# Altium project PCB_Project.PrjPcb
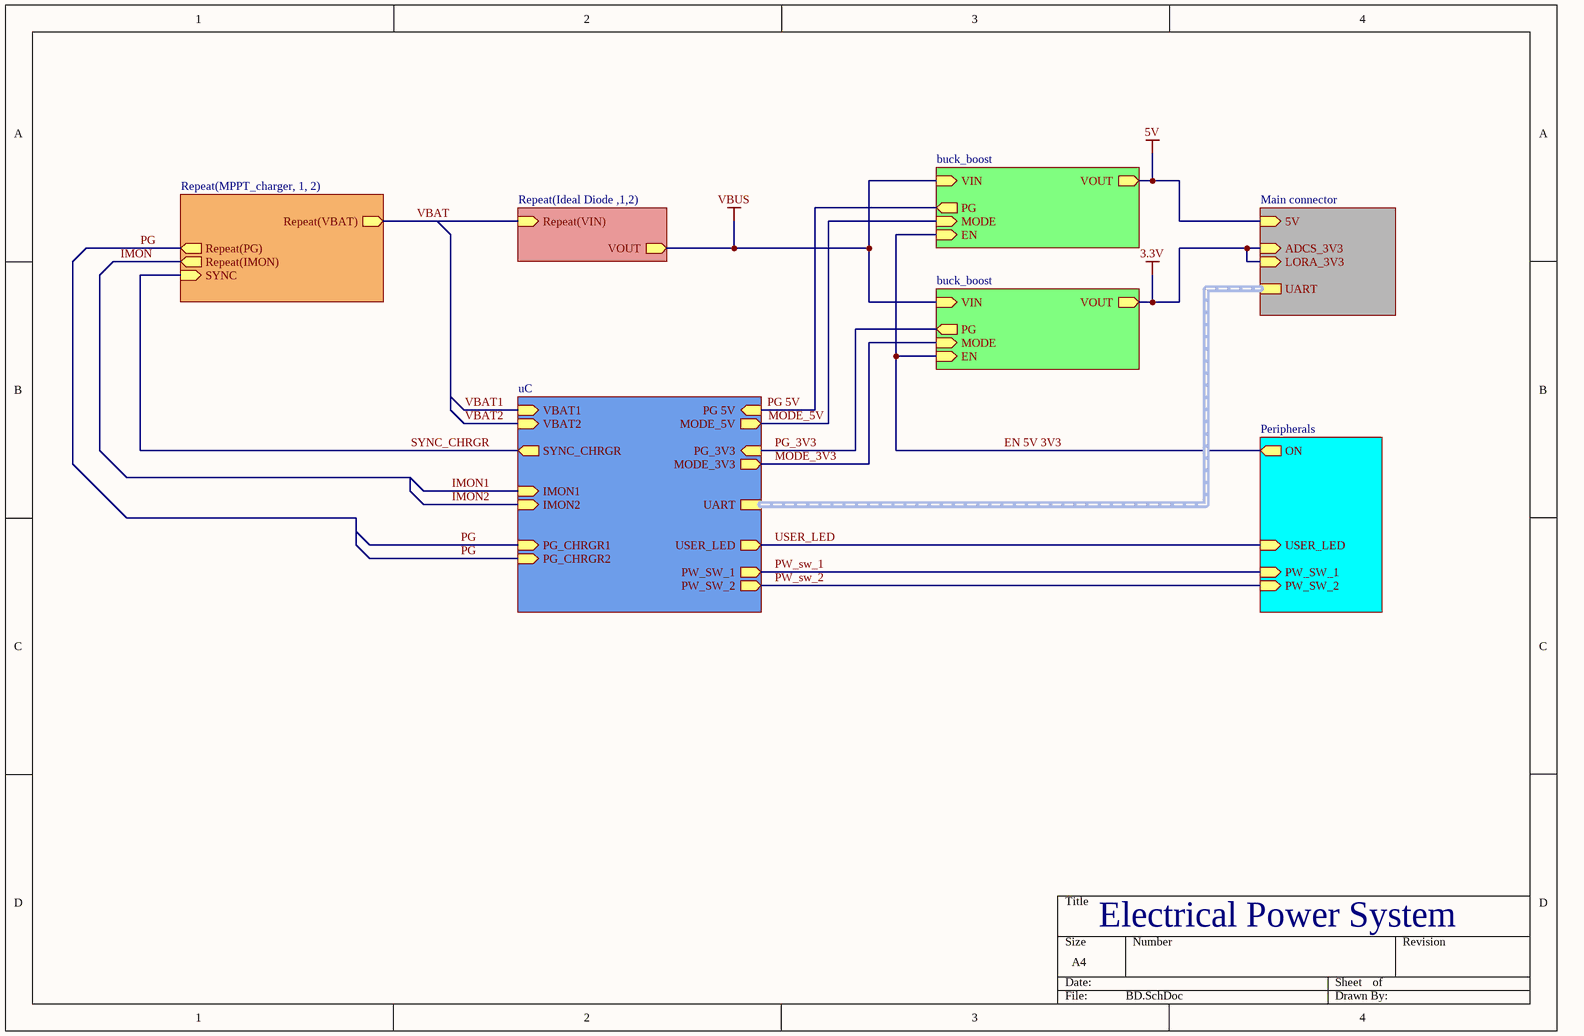
[diagram p0: BD.SchDoc]
8 sheets, 118 parts. Net scope: hierarchical (ports join the sheet entries above them; power ports are global).
Board file: 2layer.PcbDoc
Sheets:
  BD.SchDoc
    uC = Microcontroller.SchDoc
    Main connector = Board-to-board connector.SchDoc
    buck_boost = Buck-Boost converter (A).SchDoc
    buck_boost = Buck-Boost converter (B).SchDoc
    Peripherals = LED connector.SchDoc
    MPPT_charger1 = MPPT CC CV charger (A).SchDoc
    MPPT_charger2 = MPPT CC CV charger (A).SchDoc
    Ideal Diode1 = Ideal Diode (A).SchDoc
    Ideal Diode2 = Ideal Diode (A).SchDoc

## Sheet BD.SchDoc
size A4; SheetNumber: 1; SheetTotal: 10

### Sub-sheets
buck_boost = Buck-Boost converter (A).SchDoc: PG (out), VOUT (out), EN (in), MODE (in), VIN (in)
buck_boost = Buck-Boost converter (B).SchDoc: PG (out), VOUT (out), EN (in), MODE (in), VIN (in)
Main connector = Board-to-board connector.SchDoc: 5V (in), UART (harness UART), ADCS_3V3 (in), LORA_3V3 (in)
Peripherals = LED connector.SchDoc: USER_LED (in), ON (out), PW_SW_2 (in), PW_SW_1 (in)
Repeat(Ideal Diode ,1,2) = Ideal Diode (A).SchDoc: Repeat(VIN) (in), VOUT (out)
Repeat(MPPT_charger, 1, 2) = MPPT CC CV charger (A).SchDoc: Repeat(IMON) (out), SYNC (in), Repeat(PG) (out), Repeat(VBAT) (out)
uC = Microcontroller.SchDoc: IMON1 (in), IMON2 (in), PG_3V3 (in), SYNC_CHRGR (out), MODE_3V3 (out), PG 5V (in), MODE_5V (out), PG_CHRGR1 (in), PG_CHRGR2 (in), PW_SW_2 (out), PW_SW_1 (out), USER_LED (out), UART (harness UART), VBAT1 (in), VBAT2 (in)

### Nets
3.3V: sheet Main connector/ADCS_3V3, sheet Main connector/LORA_3V3, sheet buck_boost/VOUT
5V: sheet Main connector/5V, sheet buck_boost/VOUT
VBUS: sheet buck_boost/VIN, sheet buck_boost/VIN, sheet Repeat(Ideal Diode ,1,2)/VOUT
EN 5V 3V3: sheet buck_boost/EN, sheet buck_boost/EN, sheet Peripherals/ON
IMON: sheet Repeat(MPPT_charger, 1, 2)/Repeat(IMON)
MODE_3V3: sheet uC/MODE_3V3, sheet buck_boost/MODE
MODE_5V: sheet uC/MODE_5V, sheet buck_boost/MODE
PG: sheet uC/PG_CHRGR1, sheet uC/PG_CHRGR2, sheet Repeat(MPPT_charger, 1, 2)/Repeat(PG)
PG 5V: sheet uC/PG 5V, sheet buck_boost/PG
PG_3V3: sheet uC/PG_3V3, sheet buck_boost/PG
PW_sw_1: sheet uC/PW_SW_1, sheet Peripherals/PW_SW_1
PW_sw_2: sheet uC/PW_SW_2, sheet Peripherals/PW_SW_2
SYNC_CHRGR: sheet uC/SYNC_CHRGR, sheet Repeat(MPPT_charger, 1, 2)/SYNC
USER_LED: sheet uC/USER_LED, sheet Peripherals/USER_LED
VBAT: sheet Repeat(MPPT_charger, 1, 2)/Repeat(VBAT), sheet Repeat(Ideal Diode ,1,2)/Repeat(VIN)

### Buses and harness runs
harness sheet Main connector/UART = sheet uC/UART

### Notes on the sheet
- Electrical Power System

## Sheet Microcontroller.SchDoc
size A3; SheetNumber: 2; SheetTotal: 8
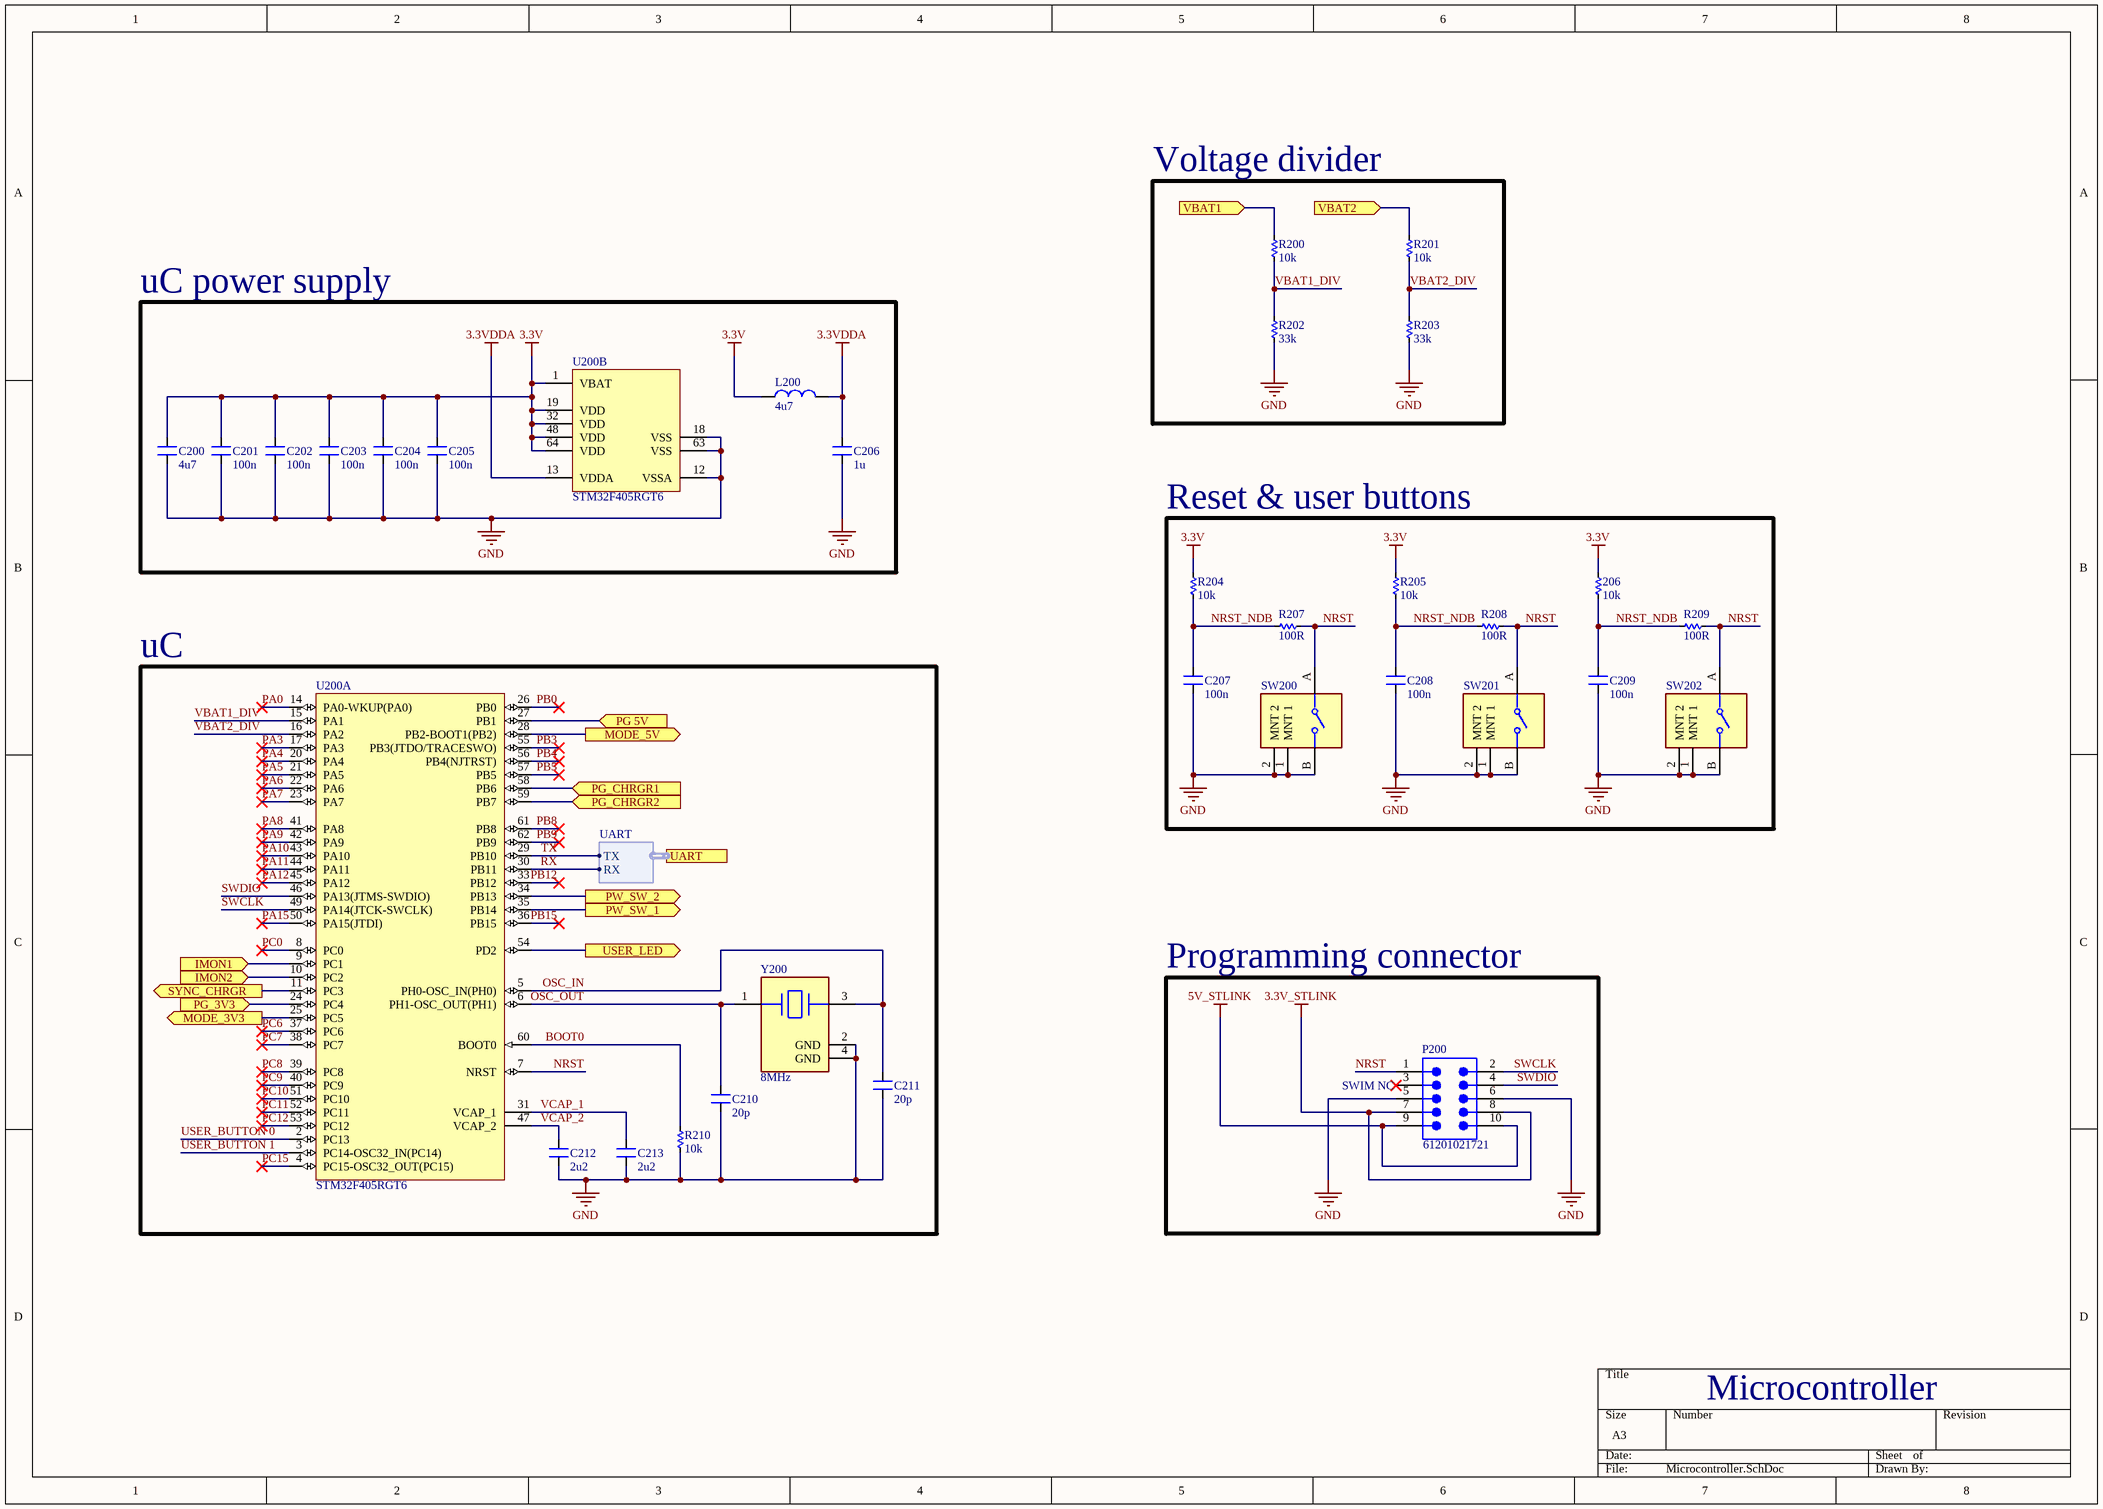
[diagram p1: Microcontroller.SchDoc]

### Parts
206  10k  [RES-SMD-0603]
C200  4u7  [CN-SMD-0603]
C201  100n  [CN-SMD-0603]
C202  100n  [CN-SMD-0603]
C203  100n  [CN-SMD-0603]
C204  100n  [CN-SMD-0603]
C205  100n  [CN-SMD-0603]
C206  1u  [CN-SMD-0603]
C207  100n  [CN-SMD-0603]
C208  100n  [CN-SMD-0603]
C209  100n  [CN-SMD-0603]
C210  20p  [CN-SMD-0603]
C211  20p  [CN-SMD-0603]
C212  2u2  [CN-SMD-0603]
C213  2u2  [CN-SMD-0603]
L200  4u7  [L-SMD-0630]
P200  61201021721  [61201021721]
R200  10k  [RES-SMD-0603]
R201  10k  [RES-SMD-0603]
R202  33k  [RES-SMD-0603]
R203  33k  [RES-SMD-0603]
R204  10k  [RES-SMD-0603]
R205  10k  [RES-SMD-0603]
R207  100R  [RES-SMD-0603]
R208  100R  [RES-SMD-0603]
R209  100R  [RES-SMD-0603]
R210  10k  [RES-SMD-0603]
SW200  EVQ-PF006K  [FP-EVQ-PF006K-MFG]  (value not drawn)
SW201  EVQ-PF006K  [FP-EVQ-PF006K-MFG]  (value not drawn)
SW202  EVQ-PF006K  [FP-EVQ-PF006K-MFG]  (value not drawn)
U200  STM32F405RGT6  [STM-LQFP64_M]  (parts A,B of 2)
Y200  8MHz  [FP-ABM3B-MFG]

### Blocks framed on the sheet
Voltage divider: R200-R203
Reset & user buttons: 206 C207-C209 R204 R205 R207-R209 SW200-SW202
uC: C210-C213 R210 U200 Y200
Programming connector: P200

### Ports
IMON1 (in, see BD[2B]), IMON2 (in, see BD[2B]), MODE_3V3 (out, see BD[2B]), MODE_5V (out, see BD[2B]), PG 5V (in, see BD[2B]), PG_3V3 (in, see BD[2B]), PG_CHRGR1 (in, see BD[2C]), PG_CHRGR2 (in, see BD[2C]), PW_SW_1 (out, see BD[2C], LED connector[2B]), PW_SW_2 (out, see BD[2C], LED connector[2C]), SYNC_CHRGR (out, see BD[2B]), UART (harness UART, see BD[2B], Board-to-board connector[2C]), USER_LED (out, see BD[2C], LED connector[1B]), VBAT1 (in, see BD[2B]), VBAT2 (in, see BD[2B])

### Harnesses
UART: TX, RX

### Nets
3.3V: 206.1 C200.2 C201.2 C202.2 C203.2 C204.2 C205.2 L200.1 R204.1 R205.1 U200.1(VBAT) U200.19(VDD) U200.32(VDD) U200.48(VDD) U200.64(VDD)
3.3V_STLINK: P200.7 P200.8
3.3VDDA: C206.2 L200.2 U200.13(VDDA)
5V_STLINK: P200.9 P200.10
GND: C200.1 C201.1 C202.1 C203.1 C204.1 C205.1 C206.1 C207.1 C208.1 C209.1 C210.1 C211.1 C212.1 C213.1 P200.5 P200.6 R202.2 R203.2 R210.2 SW200.1(MNT_1) SW200.2(MNT_2) SW200.B SW201.1(MNT_1) SW201.2(MNT_2) SW201.B SW202.1(MNT_1) SW202.2(MNT_2) SW202.B U200.12(VSSA) U200.18(VSS) U200.63(VSS) Y200.2(GND) Y200.4(GND)
BIAS_A: R200.1 ; port VBAT1
BIAS_A: R201.1 ; port VBAT2  [a separate net that carries the same name]
BOOT0: R210.1 U200.60(BOOT0)
IMON1: U200.9(PC1) ; port IMON1
IMON2: U200.10(PC2) ; port IMON2
MODE_3V3: U200.25(PC5) ; port MODE_3V3
MODE_5V: U200.28(PB2-BOOT1(PB2)) ; port MODE_5V
NRST: P200.1 R207.2 R208.2 R209.2 SW200.A SW201.A SW202.A U200.7(NRST)
NRST_NDB: 206.2 C207.2 C208.2 C209.2 R204.2 R205.2 R207.1 R208.1 R209.1
OSC_IN: C211.2 U200.5(PH0-OSC_IN(PH0)) Y200.3
OSC_OUT: C210.2 U200.6(PH1-OSC_OUT(PH1)) Y200.1
PA0: U200.14(PA0-WKUP(PA0))
PA3: U200.17(PA3)
PA4: U200.20(PA4)
PA5: U200.21(PA5)
PA6: U200.22(PA6)
PA7: U200.23(PA7)
PA8: U200.41(PA8)
PA9: U200.42(PA9)
PA10: U200.43(PA10)
PA11: U200.44(PA11)
PA12: U200.45(PA12)
PA15: U200.50(PA15(JTDI))
PB0: U200.26(PB0)
PB3: U200.55(PB3(JTDO/TRACESWO))
PB4: U200.56(PB4(NJTRST))
PB5: U200.57(PB5)
PB8: U200.61(PB8)
PB9: U200.62(PB9)
PB12: U200.33(PB12)
PB15: U200.36(PB15)
PC0: U200.8(PC0)
PC6: U200.37(PC6)
PC7: U200.38(PC7)
PC8: U200.39(PC8)
PC9: U200.40(PC9)
PC10: U200.51(PC10)
PC11: U200.52(PC11)
PC12: U200.53(PC12)
PC15: U200.4(PC15-OSC32_OUT(PC15))
PG: U200.58(PB6) U200.59(PB7) ; port PG_CHRGR1, port PG_CHRGR2
PG 5V: U200.27(PB1) ; port PG 5V
PG_3V3: U200.24(PC4) ; port PG_3V3
PW_sw_1: U200.35(PB14) ; port PW_SW_1
PW_sw_2: U200.34(PB13) ; port PW_SW_2
RX: U200.30(PB11) ; port UART.RX
SWCLK: P200.2 U200.49(PA14(JTCK-SWCLK))
SWDIO: P200.4 U200.46(PA13(JTMS-SWDIO))
SYNC_CHRGR: U200.11(PC3) ; port SYNC_CHRGR
TX: U200.29(PB10) ; port UART.TX
USER_BUTTON 0: U200.2(PC13)
USER_BUTTON 1: U200.3(PC14-OSC32_IN(PC14))
USER_LED: U200.54(PD2) ; port USER_LED
VBAT1_DIV: R200.2 R202.1 U200.15(PA1)
VBAT2_DIV: R201.2 R203.1 U200.16(PA2)
VCAP_1: C213.2 U200.31(VCAP_1)
NetC212_2: C212.2 U200.47(VCAP_2)

Not connected (* = marked no-connect by the designer): P200 3*

### Notes on the sheet
- uC power supply
- (near P200) SWIM NC
- Microcontroller
- Labels drawn without touching a wire or pin: VCAP_2

### Library data of the parts
206 R200-R205 R207-R210 = Res-SMD: Resistor; Manufacturer: Generic Components; Class: Passive; Published: 08/06/2000; Publisher: Altium Hobart Technology Centre
C200-C213 = CN: Value: 33pF
L200 = L-SMD-1: partNo: 78477010; Manufacturer: Wurth Elektronik; Inductance: 1.0 μH; ComponentLink1Description: Manufacturer; ComponentLink1URL: http://www.we-online.de; Created by: Baojun Chen; Created Date: Nov.2015; ComponentLink2Description: Datasheet; ComponentLink2URL: http://katalog.we-online.de/pbs/datasheet/78477010.pdf
P200 = CMP-1502-00021-2: NexarPartId: 8917787; Operating Supply Voltage: 250V; Number of Positions: 10; Contact Resistance: 20mΩ; Connector Type: Male Pin; Current Rating: 3A; Pitch: 2.54mm; Gender: Male; Insulation Resistance: 1GΩ; Insulation: Insulated; Max Operating Temperature: 105°C; Flammability Rating: UL94 V-0; Mount: Through Hole; Contact Material: Copper; Min Operating Temperature: -40°C; Length: 20.36mm; Number of Contacts: 10; Height: 8.85mm; Number of Rows: 2; Housing Material: PBT; Color: Black; Contact Gender: Male; Orientation: Right Angle; Contact Plating: Gold; Number of Pins: 10; Voltage Rating (DC): 250V; RoHS: Compliant; Insulation Material: PBT; REACH SVHC: Unknown; Row Spacing: 2.54mm; Voltage Rating: 250V; Width: 20.36mm; Lead Pitch: 2.54mm; Termination: Through Hole
SW200-SW202 = CMP-00287-39802768-1: EVQ-PF006K Switch Tactile N.O. SPST Round Button PC Pins 0.02A 15VDC 1N Thru-Hole Bulk; Voltage Rating (DC): 15V; Current Rating: 20mA; Actuator Length: 5.85mm; Life (Cycles): 100kcycles; Number of Positions: 2; Switch Function: Off-Mom; Switch Travel: 250µm; Contact Resistance: 50mΩ; Illumination Type: Illuminated, Non-Illuminated; NexarPartId: 39802768; Max Current Rating: 20mA; Color: Black; Height: 7.1mm; Throw Configuration: SPST; Width: 4mm; Packaging: Bulk; Mount: Through Hole; Operating Force: 1N; Lead Free: Lead Free; Contact Current Rating: 20mA; Length: 6.2mm; Max Operating Temperature: 70°C; Min Operating Temperature: -20°C; Contact Plating: Gold, Silver; Orientation: Right Angle; REACH SVHC: No SVHC; Termination: PC Pins; Mechanical Life: 100kcycles; Radiation Hardening: No; Electrical Life: 100kcycles; RoHS: Compliant; Max Voltage Rating (DC): 15V; Depth: 9.85mm
U200 = CMP-0243-00019-3: ARM Cortex-M4 32-bit MCU+FPU, 210 DMIPS, 1024 kB Flash, 192 kB Internal RAM, 51 I/Os, 64-pin LQFP, -40 to 85 degC, Tray; Manufacturer: STMicroelectronics; Supply Voltage(Vcc) min (V): 1.8; Supply Voltage(Vcc) max (V): 3.6; Internal RAM Size (kB): 192; I/Os (High Current): 51; D/A Converter: 2x12-bit; FLASH Size (Prog) (kB): 1024; Operating Frequency(F) (Processor speed) (MHz): 168; ComponentLink2Description: Datasheet; PackageVersion: Rev. 4, 06/2013; DatasheetVersion: Rev. 4; Core: ARM Cortex-M4; ComponentLink2URL: http://www.st.com/st-web-ui/static/active/en/resource/technical/document/datasheet/DM00037051.pdf; PackageReference: LQFP64; Packing: Tray; ComponentLink1Description: Manufacturer URL; ComponentLink3URL: http://www.st.com/st-web-ui/static/active/en/resource/technical/document/datasheet/DM00037051.pdf; ComponentLink3Description: Package Specification; Mounting Technology: Surface Mount; ComponentLink1URL: http://www.st.com/web/en/home.html; PackageDescription: 64-Pin Low Profile Quad Flat Package, 10 x 10 mm Body, 0.5 mm Pitch; PartNumber: STM32F405RGT6
Y200 = CMP-1688-00002-2: Crystal 8MHz ±20ppm 18pF SMD-4 5mm x 3.2mm; ESR (Equivalent Series Resistance): 200R; Frequency Stability: 50ppm; Operating Frequency: 8 MHz; Mount: Surface Mount; Number of Pins: 4; Packaging: Tape and Reel; Width: 0.126inch; Case/Package: CSMD; Lead Free: Lead Free; Depth: 3.2mm; Load Capacitance: 18pF; Min Operating Temperature: -20°C; Series: ABM3B; Package Quantity: 1000; Resistor Type: Ceramic; Height: 0.043inch; Max Operating Temperature: 70°C; Frequency Tolerance: 20ppm; Series Resistance: 200R; Tolerance: 20ppm; Termination: SMD/SMT; Length: 5mm; Frequency: 8MHz

## Sheet Board-to-board connector.SchDoc
size A4; SheetNumber: 7; SheetTotal: 8
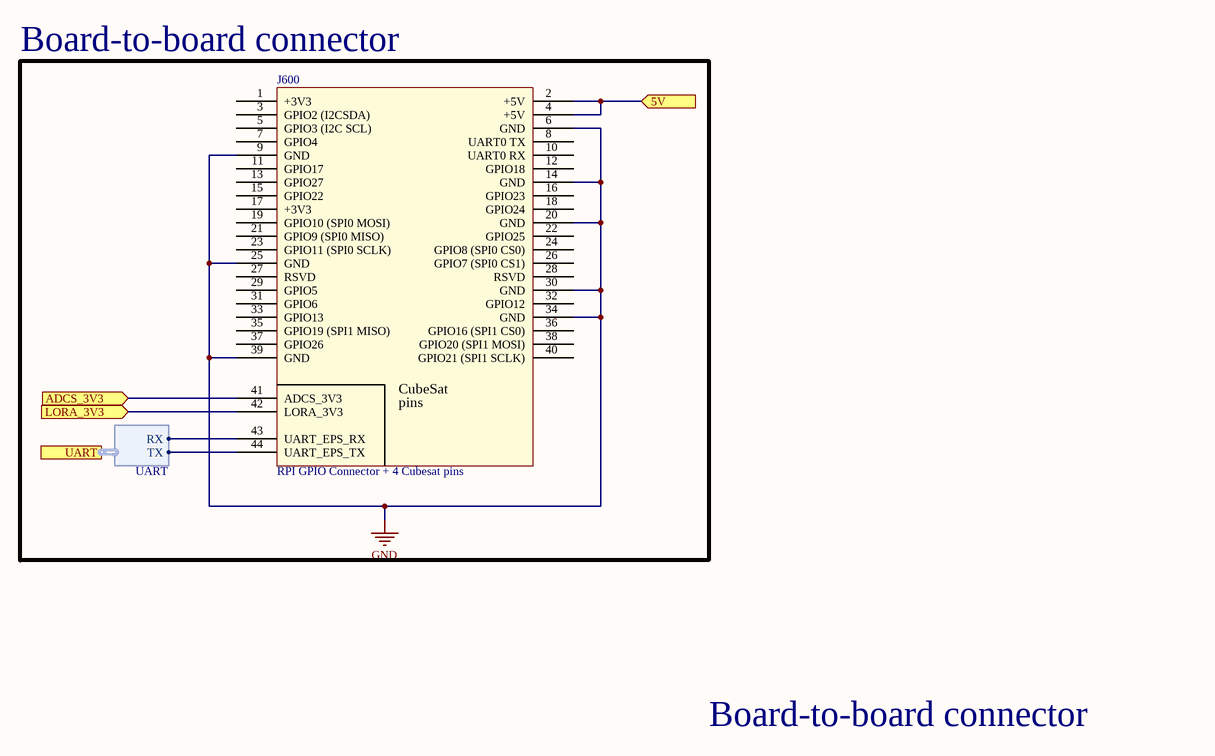
[diagram p2: Board-to-board connector.SchDoc]

### Parts
J600  RPI GPIO Connector + 4 Cubesat pins  [header 40 pins]

### Blocks framed on the sheet
Board-to-board connector: J600

### Ports
5V (in), ADCS_3V3 (in), LORA_3V3 (in), UART (harness UART, see Microcontroller[3C])

### Harnesses
UART: TX, RX

### Nets
3.3V: J600.41(ADCS_3V3) J600.42(LORA_3V3) ; port ADCS_3V3, port LORA_3V3
5V: J600.2(+5V) J600.4(+5V) ; port 5V
GND: J600.6(GND) J600.9(GND) J600.14(GND) J600.20(GND) J600.25(GND) J600.30(GND) J600.34(GND) J600.39(GND)
RX: J600.43(UART_EPS_RX) ; port UART.RX
TX: J600.44(UART_EPS_TX) ; port UART.TX

Not connected (* = marked no-connect by the designer): J600 1(+3V3) 3(GPIO2_(I2CSDA)) 5(GPIO3_(I2C_SCL)) 7(GPIO4) 8(UART0_TX) 10(UART0_RX) 11(GPIO17) 12(GPIO18) 13(GPIO27) 15(GPIO22) 16(GPIO23) 17(+3V3) 18(GPIO24) 19(GPIO10_(SPI0_MOSI)) 21(GPIO9_(SPI0_MISO)) 22(GPIO25) 23(GPIO11_(SPI0_SCLK)) 24(GPIO8_(SPI0_CS0)) 26(GPIO7_(SPI0_CS1)) 27(RSVD) 28(RSVD) 29(GPIO5) 31(GPIO6) 32(GPIO12) 33(GPIO13) 35(GPIO19_(SPI1_MISO)) 36(GPIO16_(SPI1_CS0)) 37(GPIO26) 38(GPIO20_(SPI1_MOSI)) 40(GPIO21_(SPI1_SCLK))

### Notes on the sheet
- Board-to-board connector
- (in symbol Header 40 pins) CubeSat; pins

### Library data of the parts
J600 = Header 40 pins

## Sheet Buck-Boost converter (A).SchDoc
size A4; SheetNumber: 5; SheetTotal: 10
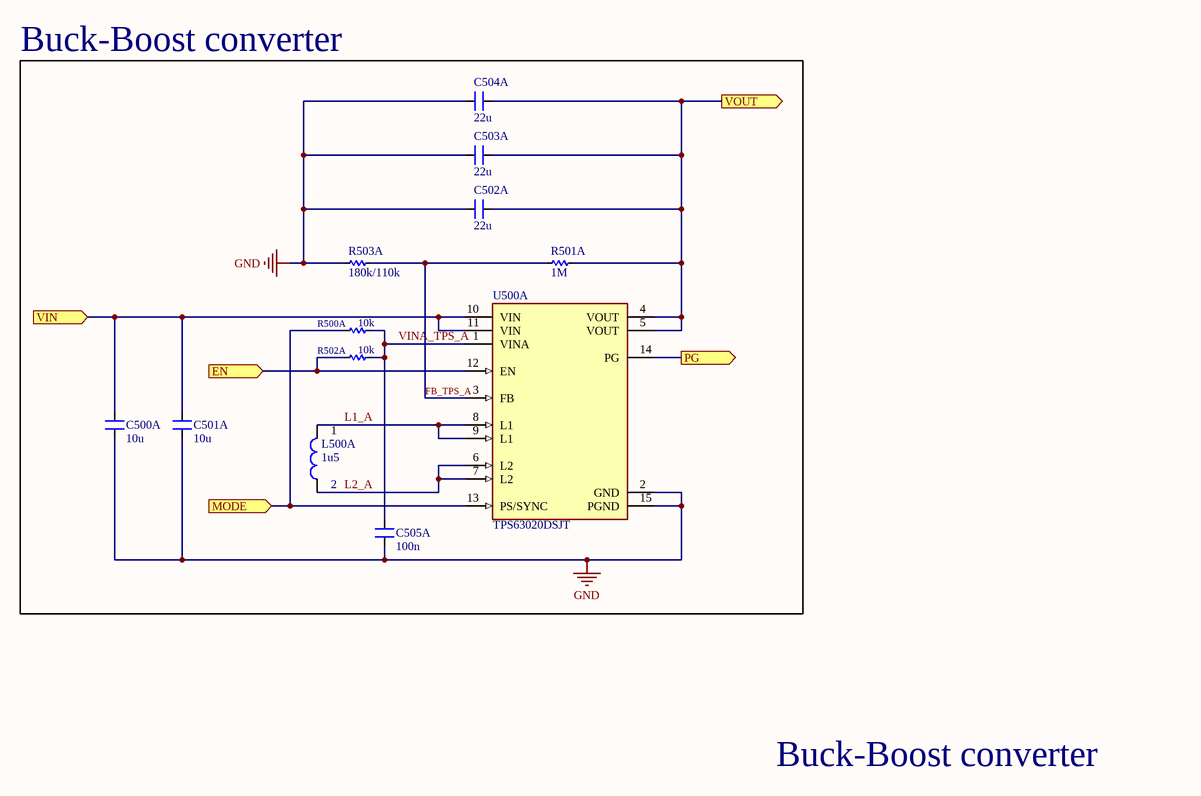
[diagram p3: Buck-Boost converter (A).SchDoc]

### Parts
C500A  10u  [CN-SMD-0603]
C501A  10u  [CN-SMD-0603]
C502A  22u  [CN-SMD-0603]
C503A  22u  [CN-SMD-0603]
C504A  22u  [CN-SMD-0603]
C505A  100n  [CN-SMD-0603]
L500A  1u5  [L-SMD-0630]
R500A  10k  [RES-SMD-0603]
R501A  1M  [RES-SMD-0603]
R502A  10k  [RES-SMD-0603]
R503A  180k/110k  [RES-SMD-0603]
U500A  TPS63020DSJT  [FP-DSJ0014A-MFG]

### Ports
EN (in, see BD[3A], Buck-Boost converter (B)[2C]), MODE (in, see BD[3A]), PG (out, see BD[3A]), VIN (in, see BD[3A], Buck-Boost converter (B)[1B]), VOUT (out, see BD[3A])

### Nets
5V: C502A.1 C503A.1 C504A.1 R501A.1 U500A.4(VOUT) U500A.5(VOUT) ; port VOUT
GND: C500A.1 C501A.1 C502A.2 C503A.2 C504A.2 C505A.1 R503A.2 U500A.2(GND) U500A.15(PGND)
VBUS: C500A.2 C501A.2 U500A.10(VIN) U500A.11(VIN) ; port VIN
EN 5V 3V3: R502A.2 U500A.12(EN) ; port EN
FB_TPS_A: R501A.2 R503A.1 U500A.3(FB)
L1_A: L500A.2 U500A.8(L1) U500A.9(L1)
L2_A: L500A.1 U500A.6(L2) U500A.7(L2)
MODE_5V: R500A.2 U500A.13(PS/SYNC) ; port MODE
PG 5V: U500A.14(PG) ; port PG
VINA_TPS_A: C505A.2 R500A.1 R502A.1 U500A.1(VINA)

### Notes on the sheet
- Buck-Boost converter
- (near L500A) 1
- (near L500A) 2

### Library data of the parts
C500A C501A C502A C503A C504A C505A = CN: Value: 33pF
L500A = L-SMD-1: as L200 on sheet Microcontroller; ComponentLink1Description: Manufacturer; ComponentLink1URL: http://www.we-online.de; Created by: Baojun Chen; Created Date: Nov.2015; ComponentLink2Description: Datasheet; ComponentLink2URL: http://katalog.we-online.de/pbs/datasheet/78477010.pdf
R500A R501A R502A R503A = Res-SMD: as 206 on sheet Microcontroller; Published: 08/06/2000; Publisher: Altium Hobart Technology Centre
U500A = CMP-2000-07282-2: IC REG BCK BST ADJ 3.5A 14VSON; Manufacturer: Texas Instruments; Switching Frequency: 2400kHz; Output Voltage: 1.2-5.5V; Nominal Supply Current: 25uA; Standoff Height: 0mm; Switching Topology: Buck-Boost; Min Supply Voltage: 1.8V; Output Type: AdjustableProgrammable; Max Junction Temp: +125°C; Number Of Outputs: 1; Output Current: 3A; Max Supply Voltage: 5.5V; ComponentLink2URL: https://www.ti.com/lit/ds/symlink/tps63020.pdf; Ambient Temperature Range High: +85°C; Digikey Description: IC REG BCK BST ADJ 3.5A 14VSON; Ambient Temperature Range Low: -40°C; Manufacturer Part Number: TPS63020DSJT; Automotive: No; Package: DSJ0014A; Category: IC; Temperature Range High: +85°C; Temperature: -40°C to +85°C; Octopart: https://octopart.com/tps63020dsjt-texas+instruments-12976119; Temperature Range Low: -40°C; Device Class L3: Voltage Regulators - Switching; Device Class L2: Power Management ICs; RoHS: TRUE; Lead Free: Yes; Height: 1mm; Device Class L1: Integrated Circuits (ICs); Mouser Description: Voltage Regulators - Switching Regulators 93% Eff Buck-Boost Converter; ComponentLink2Description: Datasheet

## Sheet Buck-Boost converter (B).SchDoc
size A4; SheetNumber: 6; SheetTotal: 8
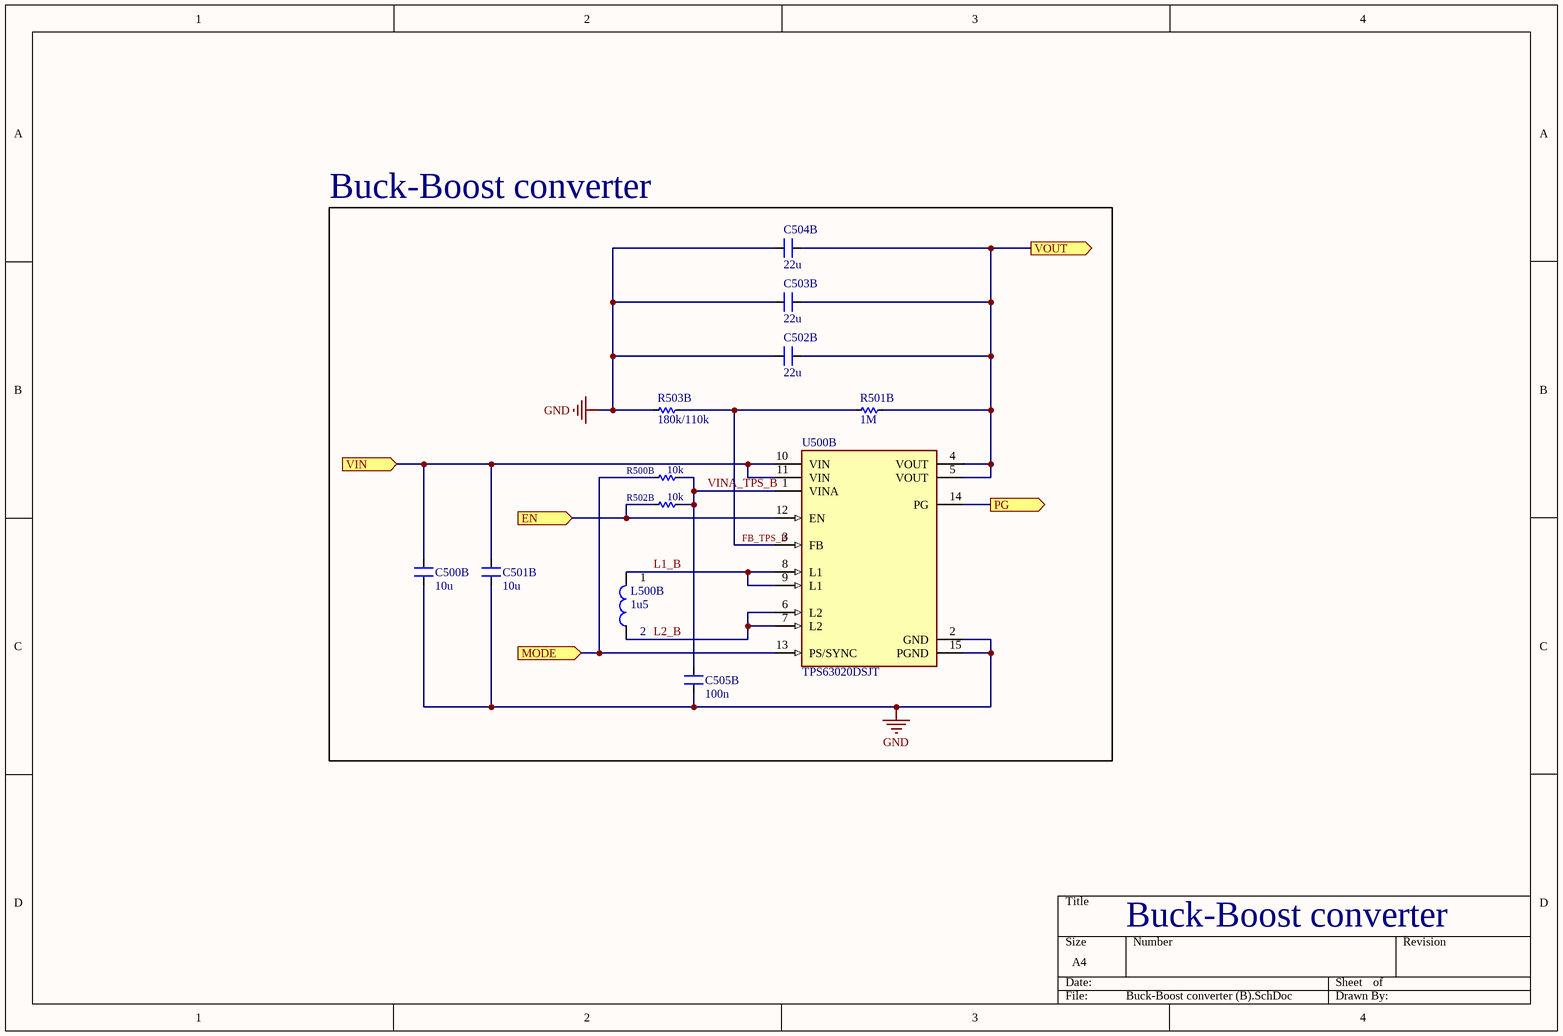
[diagram p4: Buck-Boost converter (B).SchDoc]

### Parts
C500B  10u  [CN-SMD-0603]
C501B  10u  [CN-SMD-0603]
C502B  22u  [CN-SMD-0603]
C503B  22u  [CN-SMD-0603]
C504B  22u  [CN-SMD-0603]
C505B  100n  [CN-SMD-0603]
L500B  1u5  [L-SMD-0630]
R500B  10k  [RES-SMD-0603]
R501B  1M  [RES-SMD-0603]
R502B  10k  [RES-SMD-0603]
R503B  180k/110k  [RES-SMD-0603]
U500B  TPS63020DSJT  [FP-DSJ0014A-MFG]

### Ports
EN (in, see Buck-Boost converter (A)[2C]), MODE (in, see Buck-Boost converter (A)[2C]), PG (out, see Buck-Boost converter (A)[3C], MPPT CC CV charger (A)[3B], MPPT CC CV charger (B)[3B]), VIN (in, see Buck-Boost converter (A)[1B], Ideal Diode[1B], Ideal Diode[3B]), VOUT (out, see Buck-Boost converter (A)[3B])

### Nets
3.3V: C502B.1 C503B.1 C504B.1 R501B.1 U500B.4(VOUT) U500B.5(VOUT) ; port VOUT
GND: C500B.1 C501B.1 C502B.2 C503B.2 C504B.2 C505B.1 R503B.2 U500B.2(GND) U500B.15(PGND)
VBUS: C500B.2 C501B.2 U500B.10(VIN) U500B.11(VIN) ; port VIN
EN 5V 3V3: R502B.2 U500B.12(EN) ; port EN
FB_TPS_B: R501B.2 R503B.1 U500B.3(FB)
L1_B: L500B.2 U500B.8(L1) U500B.9(L1)
L2_B: L500B.1 U500B.6(L2) U500B.7(L2)
MODE_3V3: R500B.2 U500B.13(PS/SYNC) ; port MODE
PG_3V3: U500B.14(PG) ; port PG
VINA_TPS_B: C505B.2 R500B.1 R502B.1 U500B.1(VINA)

### Notes on the sheet
- Buck-Boost converter
- (near L500B) 1
- (near L500B) 2

### Library data of the parts
C500B C501B C502B C503B C504B C505B = CN: Value: 33pF
L500B = L-SMD-1: as L200 on sheet Microcontroller; ComponentLink1Description: Manufacturer; ComponentLink1URL: http://www.we-online.de; Created by: Baojun Chen; Created Date: Nov.2015; ComponentLink2Description: Datasheet; ComponentLink2URL: http://katalog.we-online.de/pbs/datasheet/78477010.pdf
R500B R501B R502B R503B = Res-SMD: as 206 on sheet Microcontroller; Published: 08/06/2000; Publisher: Altium Hobart Technology Centre
U500B = CMP-2000-07282-2: as U500A on sheet Buck-Boost converter (A); ComponentLink2URL: https://www.ti.com/lit/ds/symlink/tps63020.pdf; Ambient Temperature Range High: +85°C; Digikey Description: IC REG BCK BST ADJ 3.5A 14VSON; Ambient Temperature Range Low: -40°C; Manufacturer Part Number: TPS63020DSJT; Automotive: No; Package: DSJ0014A; Category: IC; Temperature Range High: +85°C; Temperature: -40°C to +85°C; Octopart: https://octopart.com/tps63020dsjt-texas+instruments-12976119; Temperature Range Low: -40°C; Device Class L3: Voltage Regulators - Switching; Device Class L2: Power Management ICs; RoHS: TRUE; Lead Free: Yes; Height: 1mm; Device Class L1: Integrated Circuits (ICs); Mouser Description: Voltage Regulators - Switching Regulators 93% Eff Buck-Boost Converter; ComponentLink2Description: Datasheet

## Sheet LED connector.SchDoc
size A4; SheetNumber: 8; SheetTotal: 8
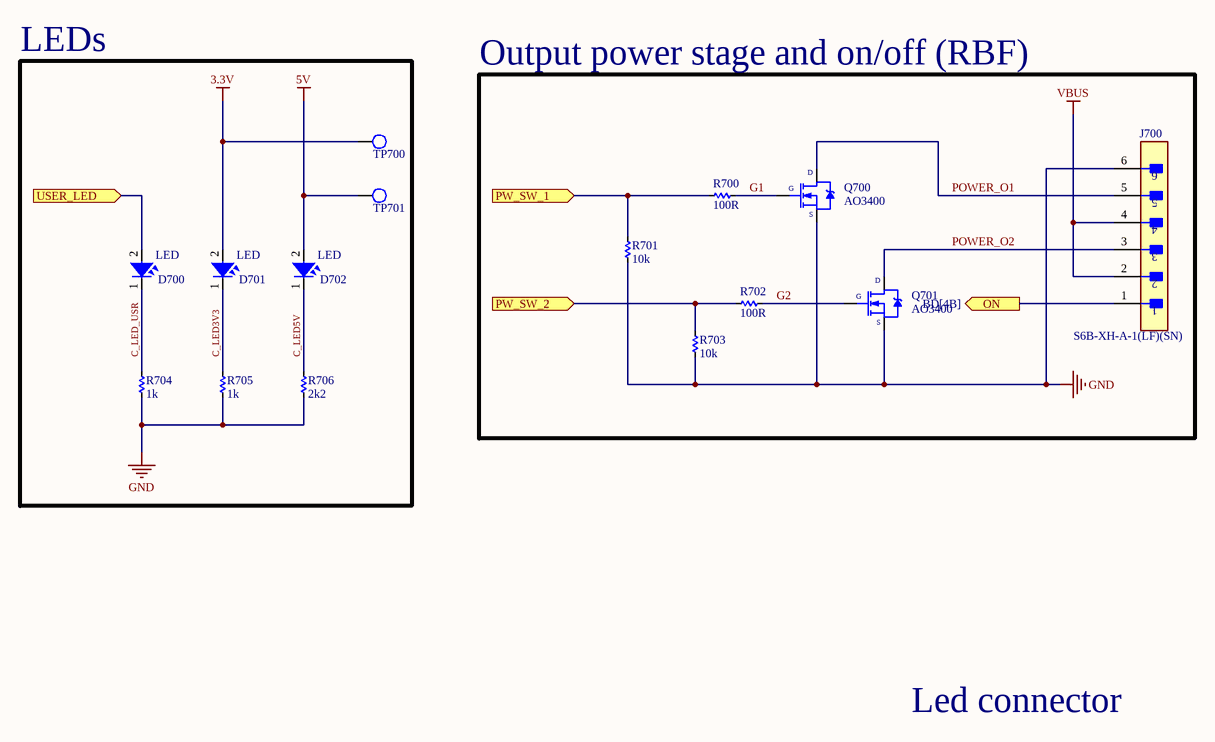
[diagram p5: LED connector.SchDoc]

### Parts
D700  LED  [LED-0805-Green]
D701  LED  [LED-0805-Green]
D702  LED  [LED-0805-Green]
J700  S6B-XH-A-1(LF)(SN)  [FP-S6B-XH-A-1_LF_SN-MFG]
Q700  AO3400  [SOT23-123]
Q701  AO3400  [SOT23-123]
R700  100R  [RES-SMD-0603]
R701  10k  [RES-SMD-0603]
R702  100R  [RES-SMD-0603]
R703  10k  [RES-SMD-0603]
R704  1k  [RES-SMD-0603]
R705  1k  [RES-SMD-0603]
R706  2k2  [RES-SMD-0603]
TP700  Test-Point  [TESTPOINT]  (value not drawn)
TP701  Test-Point  [TESTPOINT]  (value not drawn)

### Blocks framed on the sheet
LEDs: D700-D702 R704-R706 TP700 TP701
Output power stage and on/off (RBF): J700 Q700 Q701 R700-R703

### Ports
ON (out, see BD[4B]), PW_SW_1 (in, see BD[4C], Microcontroller[3C]), PW_SW_2 (in, see BD[4C], Microcontroller[3C]), USER_LED (in, see BD[4C], Microcontroller[3C])

### Nets
3.3V: D701.1 TP700.1
5V: D702.1 TP701.1
GND: J700.6 Q700.3(S) Q701.3(S) R701.2 R703.2 R704.2 R705.2 R706.2
VBUS: J700.2 J700.4
C_LED3V3: D701.2 R705.1
C_LED5V: D702.2 R706.1
C_LED_USR: D700.2 R704.1
EN 5V 3V3: J700.1 ; port ON
G1: Q700.1(G) R700.1
G2: Q701.1(G) R702.1
POWER_O1: J700.5 Q700.2(D)
POWER_O2: J700.3 Q701.2(D)
PW_sw_1: R700.2 R701.1 ; port PW_SW_1
PW_sw_2: R702.2 R703.1 ; port PW_SW_2
USER_LED: D700.1 ; port USER_LED

### Notes on the sheet
- (near D700) 1
- (near D700) 2
- (near D701) 1
- (near D701) 2
- (near D702) 1
- (near D702) 2
- Led connector

### Library data of the parts
D700-D702 = LED SMD: Value: LED 3 - 5 ly 2 Colour
J700 = CMP-17439-000023-1: CONN HEADER R/A P6OS 2.5MM; Voltage Rating: 250V; Insulation Resistance: 1GR; Current Rating: 3A; Number of Positions: 6; Gender: Male; Mount: Through Hole; Material: Polyamide; Max Operating Temperature: 85°C; Contact Plating: Tin; Number of Rows: 1; Color: Natural; Termination: Crimp; Min Operating Temperature: -25°C; Pitch: 2.5mm; Lead Free: Lead Free; Contact Material: Brass
Q700 Q701 = AO3400: N-MOS 30V 5.8A
R700-R706 = Res-SMD: as 206 on sheet Microcontroller; Published: 08/06/2000; Publisher: Altium Hobart Technology Centre

## Sheet MPPT CC CV charger (A).SchDoc
size A4; SheetNumber: 3; SheetTotal: 10
Used 2 times, as channels MPPT_charger1, MPPT_charger2. Parts and nets are listed once, with the designators drawn on the sheet.
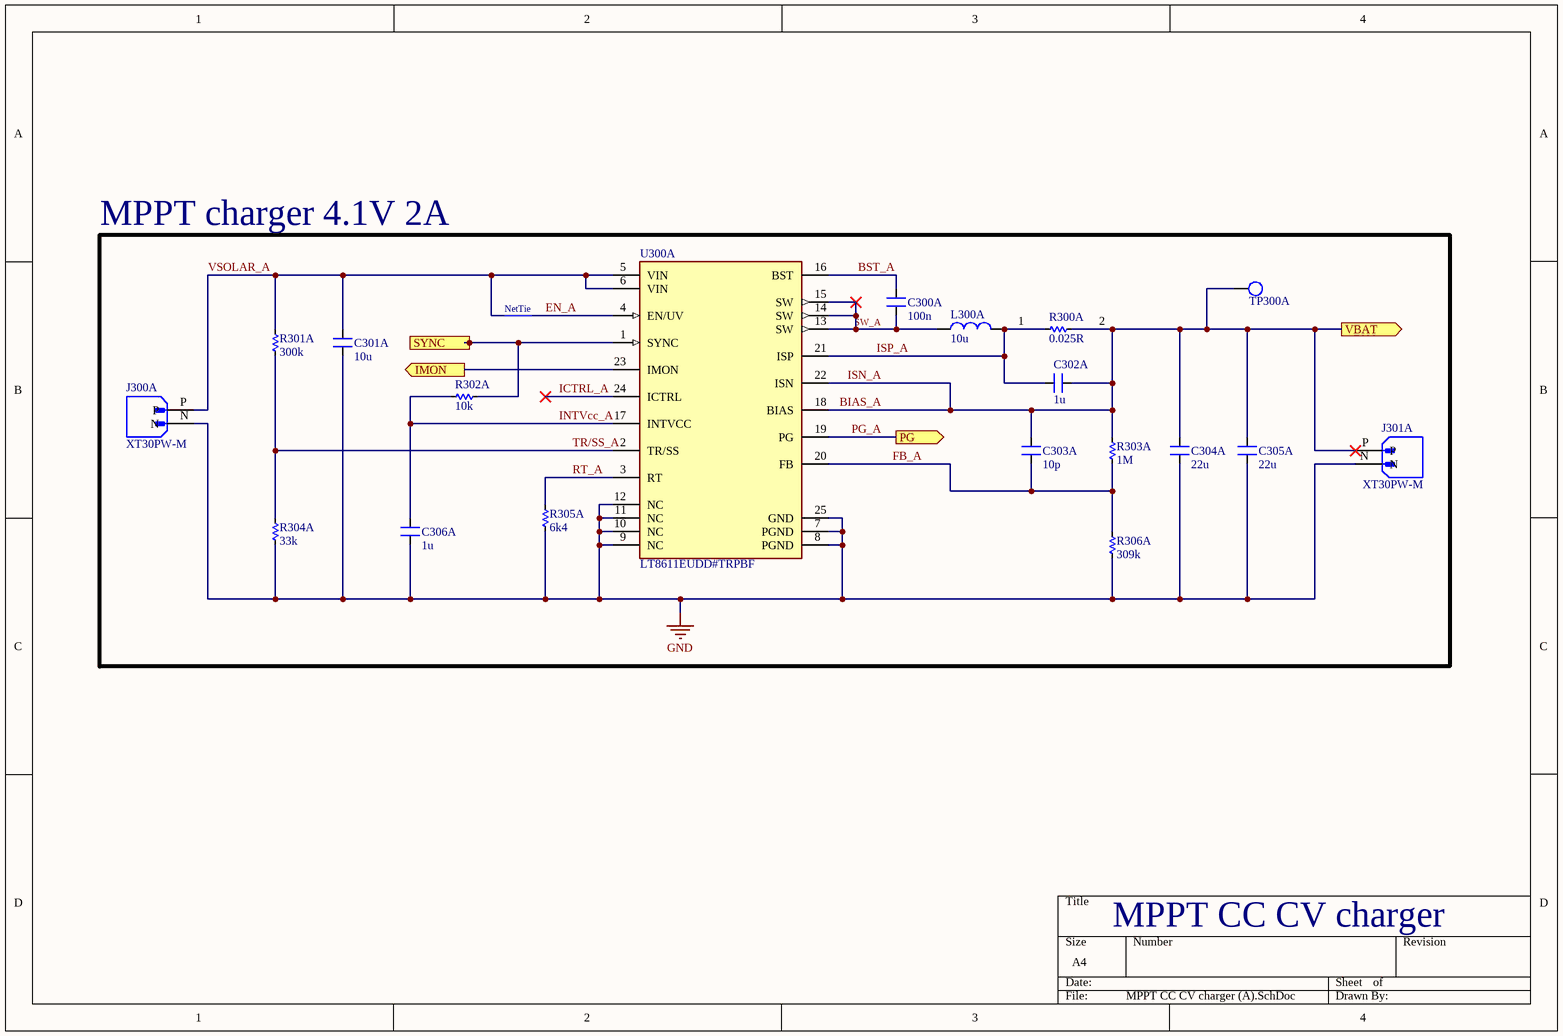
[diagram p6: MPPT CC CV charger (A).SchDoc]

### Parts
C300A  100n  [CN-SMD-0603]
C301A  10u  [CN-SMD-0603]
C302A  1u  [CN-SMD-0603]
C303A  10p  [CN-SMD-0603]
C304A  22u  [CN-SMD-0603]
C305A  22u  [CN-SMD-0603]
C306A  1u  [CN-SMD-0603]
J300A  XT30PW-M  [AMASS_XT30PW-M]
J301A  XT30PW-M  [AMASS_XT30PW-M]
L300A  10u  [L-SMD-M-7.3x4.5]
R300A  0.025R  [RES-SMD-0603]
R301A  300k  [RES-SMD-0603]
R302A  10k  [RES-SMD-0603]
R303A  1M  [RES-SMD-0603]
R304A  33k  [RES-SMD-0603]
R305A  6k4  [RES-SMD-0603]
R306A  309k  [RES-SMD-0603]
TP300A  Test-Point  [TESTPOINT]  (value not drawn)
U300A  LT8611EUDD#TRPBF  [FP-UDD-24-05-08-1833-IPC_B]

### Ports
IMON (out, see BD[1B]), PG (out, see BD[1A]), SYNC (in, see BD[1B]), VBAT (out, see BD[1A])

### Nets
GND: C301A.1 C304A.1 C305A.1 C306A.1 J300A.N J301A.N R304A.1 R305A.1 R306A.2 U300A.7(PGND) U300A.8(PGND) U300A.9(NC) U300A.10(NC) U300A.11(NC) U300A.12(NC) U300A.25(GND)
BIAS_A: C302A.2 C303A.2 C304A.2 C305A.2 J301A.P R300A.1 R303A.1 TP300A.1 U300A.18(BIAS) U300A.22(ISN) ; port VBAT  [also labelled ISN_A]
BST_A: C300A.2 U300A.16(BST)
EN_A: C301A.2 J300A.P R301A.2 U300A.4(EN/UV) U300A.5(VIN) U300A.6(VIN)  [also labelled VSOLAR_A]
FB_A: C303A.1 R303A.2 R306A.1 U300A.20(FB)
ICTRL_A: U300A.24(ICTRL)
IMON: U300A.23(IMON) ; port IMON
INTVcc_A: C306A.2 R302A.2 U300A.17(INTVCC)
ISP_A: C302A.1 L300A.2 R300A.2 U300A.21(ISP)
PG_A: U300A.19(PG) ; port PG
RT_A: R305A.2 U300A.3(RT)
SW_A: C300A.1 L300A.1 U300A.13(SW) U300A.14(SW) U300A.15(SW)
SYNC: R302A.1 U300A.1(SYNC) ; port SYNC
TR/SS_A: R301A.1 R304A.2 U300A.2(TR/SS)

### Channels
MPPT_charger1: ports IMON=IMON1 PG=PG1 SYNC=SYNC_CHRGR VBAT=BIAS_A
MPPT_charger2: designators C300A=C300B C301A=C301B C302A=C302B C303A=C303B C304A=C304B C305A=C305B C306A=C306B J300A=J300B J301A=J301B L300A=L300B R300A=R300B R301A=R301B R302A=R302B R303A=R303B R304A=R304B R305A=R305B R306A=R306B TP300A=TP300B U300A=U300B; ports IMON=IMON2 PG=PG2 SYNC=SYNC_CHRGR VBAT=BIAS_A

### Notes on the sheet
- MPPT charger 4.1V 2A
- NetTie
- 1
- (near R300A) 2
- MPPT CC CV charger

### Library data of the parts
C300A C301A C302A C303A C304A C305A C306A = CN: Value: 33pF
J300A J301A = XT30PW-M: Socket; DC supply; XT30; male; PIN: 2; on PCBs; THT; Colour: yellow; MF: AMASS; SnapEDA_Link: https://www.snapeda.com/parts/XT30PW-M/AMASS/view-part/?ref=snap; Package: None; Value: *; MP: XT30PW-M; Check_prices: https://www.snapeda.com/parts/XT30PW-M/AMASS/view-part/?ref=eda
L300A = L-SMD-1: as L200 on sheet Microcontroller; ComponentLink1Description: Manufacturer; ComponentLink1URL: http://www.we-online.de; Created by: Baojun Chen; Created Date: Nov.2015; ComponentLink2Description: Datasheet; ComponentLink2URL: http://katalog.we-online.de/pbs/datasheet/78477010.pdf
R300A R301A R302A R303A R304A R305A R306A = Res-SMD: as 206 on sheet Microcontroller; Published: 08/06/2000; Publisher: Altium Hobart Technology Centre
U300A = CMP-0491-02169-2: IC REG BUCK ADJ 2.5A 24QFN; Synchronous Rectifier: Yes; Number of Outputs: 1; Output Type: Adjustable; Switching Frequency: 2MHz; Efficiency: 96%; Output Voltage: 40V; Max Operating Temperature: 125°C; Output Current: 2.5A; RoHS Compliant: Yes; Case/Package: QFN; Package Quantity: 2500; Lead Free: Lead Free; Series: -; Number of Pins: 24; Min Operating Temperature: -40°C; Packaging: Tape and Reel

## Sheet Ideal Diode (A).SchDoc
size A4; SheetNumber: 4; SheetTotal: 10
Used 2 times, as channels Ideal Diode1, Ideal Diode2. Parts and nets are listed once, with the designators drawn on the sheet.
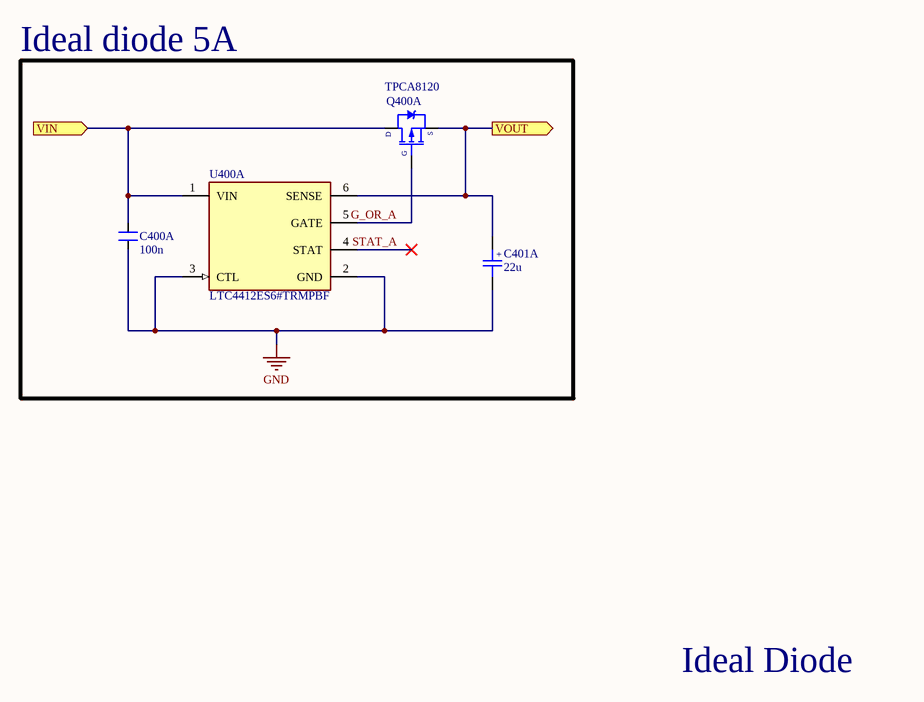
[diagram p7: Ideal Diode (A).SchDoc]

### Parts
C400A  100n  [CN-SMD-0603]
C401A  22u  [CAP_TANT_0603]
Q400A  TPCA8120  [Mosfet P channel]
U400A  LTC4412ES6#TRMPBF  [FP-S6-6-05-08-1636-IPC_C]

### Blocks framed on the sheet
Ideal diode 5A: C400A C401A Q400A U400A

### Ports
VIN (in, see BD[2A]), VOUT (out, see BD[2A])

### Nets
GND: C400A.1 C401A.K U400A.2(GND) U400A.3(CTL)
G_OR_A: Q400A.4(G) U400A.5(GATE)
STAT_A: U400A.4(STAT)
VIN: C400A.2 Q400A.5,6,7,8(D) U400A.1(VIN) ; port VIN
VOUT: C401A.A Q400A.1,2,3(S) U400A.6(SENSE) ; port VOUT

### Channels
Ideal Diode1: ports VIN=BIAS_A VOUT=VBUS
Ideal Diode2: designators C400A=C400B C401A=C401B Q400A=Q400B U400A=U400B; ports VIN=BIAS_A VOUT=VBUS

### Notes on the sheet
- Ideal Diode
- (in symbol CAP_TANT_0603) +

### Library data of the parts
C400A = CN: Value: 33pF
C401A = CAP_TANT_0603: Capacitor SMD Tantalum 0603; Manufacturer: *; Manufacturer Part Number: *; Distributor Link: *; LCSC: *
Q400A = Mosfet P channel
U400A = CMP-0479-00425-2: IC OR CTRLR SRC SELECT TSOT23-6; Min Supply Voltage: 2.5V; Max Supply Voltage: 28V; Turn-On Delay Time: 110us; Number of Channels: 1; Lead Free: Lead Free; Length: 2.9mm; Radiation Hardening: No; RoHS Compliant: Yes; Package Quantity: 1; Min Operating Temperature: -40°C; Series: PowerPath™; Packaging: Tape and Reel; Width: 1.75mm; Height: 0.9mm; Number of Pins: 6; Max Operating Temperature: 85°C; Number of Outputs: 1; Case/Package: TSOT; REACH SVHC: No SVHC

## Nets that join several sheets
3.3V: Microcontroller (15 pins), Board-to-board connector (J600.41 J600.42), Buck-Boost converter (B) (6 pins), LED connector (D701.1 TP700.1)
5V: Board-to-board connector (J600.2 J600.4), Buck-Boost converter (A) (6 pins), LED connector (D702.1 TP701.1)
GND: Microcontroller (33 pins), Board-to-board connector (8 pins), Buck-Boost converter (A) (9 pins), Buck-Boost converter (B) (9 pins), LED connector (8 pins), MPPT_charger1 (16 pins), MPPT_charger2 (16 pins), Ideal Diode1 (C400A.1 C401A.K U400A.2 U400A.3), Ideal Diode2 (C400B.1 C401B.K U400B.2 U400B.3)
VBUS: Buck-Boost converter (A) (C500A.2 C501A.2 U500A.10 U500A.11), Buck-Boost converter (B) (C500B.2 C501B.2 U500B.10 U500B.11), LED connector (J700.2 J700.4), Ideal Diode1 (C401A.A Q400A.1,2,3 U400A.6), Ideal Diode2 (C401B.A Q400B.1,2,3 U400B.6)
BIAS_A: Microcontroller (R200.1), MPPT_charger1 (10 pins), Ideal Diode1 (C400A.2 Q400A.5,6,7,8 U400A.1)
BIAS_A: Microcontroller (R201.1), MPPT_charger2 (10 pins), Ideal Diode2 (C400B.2 Q400B.5,6,7,8 U400B.1)
EN 5V 3V3: Buck-Boost converter (A) (R502A.2 U500A.12), Buck-Boost converter (B) (R502B.2 U500B.12), LED connector (J700.1)
IMON1: Microcontroller (U200.9), MPPT_charger1 (U300A.23)
IMON2: Microcontroller (U200.10), MPPT_charger2 (U300B.23)
MODE_3V3: Microcontroller (U200.25), Buck-Boost converter (B) (R500B.2 U500B.13)
MODE_5V: Microcontroller (U200.28), Buck-Boost converter (A) (R500A.2 U500A.13)
PG 5V: Microcontroller (U200.27), Buck-Boost converter (A) (U500A.14)
PG_3V3: Microcontroller (U200.24), Buck-Boost converter (B) (U500B.14)
PW_sw_1: Microcontroller (U200.35), LED connector (R700.2 R701.1)
PW_sw_2: Microcontroller (U200.34), LED connector (R702.2 R703.1)
RX: Microcontroller (U200.30), Board-to-board connector (J600.43)
SYNC_CHRGR: Microcontroller (U200.11), MPPT_charger1 (R302A.1 U300A.1), MPPT_charger2 (R302B.1 U300B.1)
TX: Microcontroller (U200.29), Board-to-board connector (J600.44)
USER_LED: Microcontroller (U200.54), LED connector (D700.1)